# Altium schematic sheet Sheet1.SchDoc
size A4; SheetNumber: 1; SheetTotal: 2; SPICEModelCacheYMMYHAXJ: <root> / <DocumentId>YMMYHAXJ</DocumentId> / <CacheFrame Number="0"> / <Model Name="cap" Kind="MDL"> / <Text>*Default semiconductor capacitor / .MODEL CAP C()</Text> / </Model> / </CacheFrame> / </root>
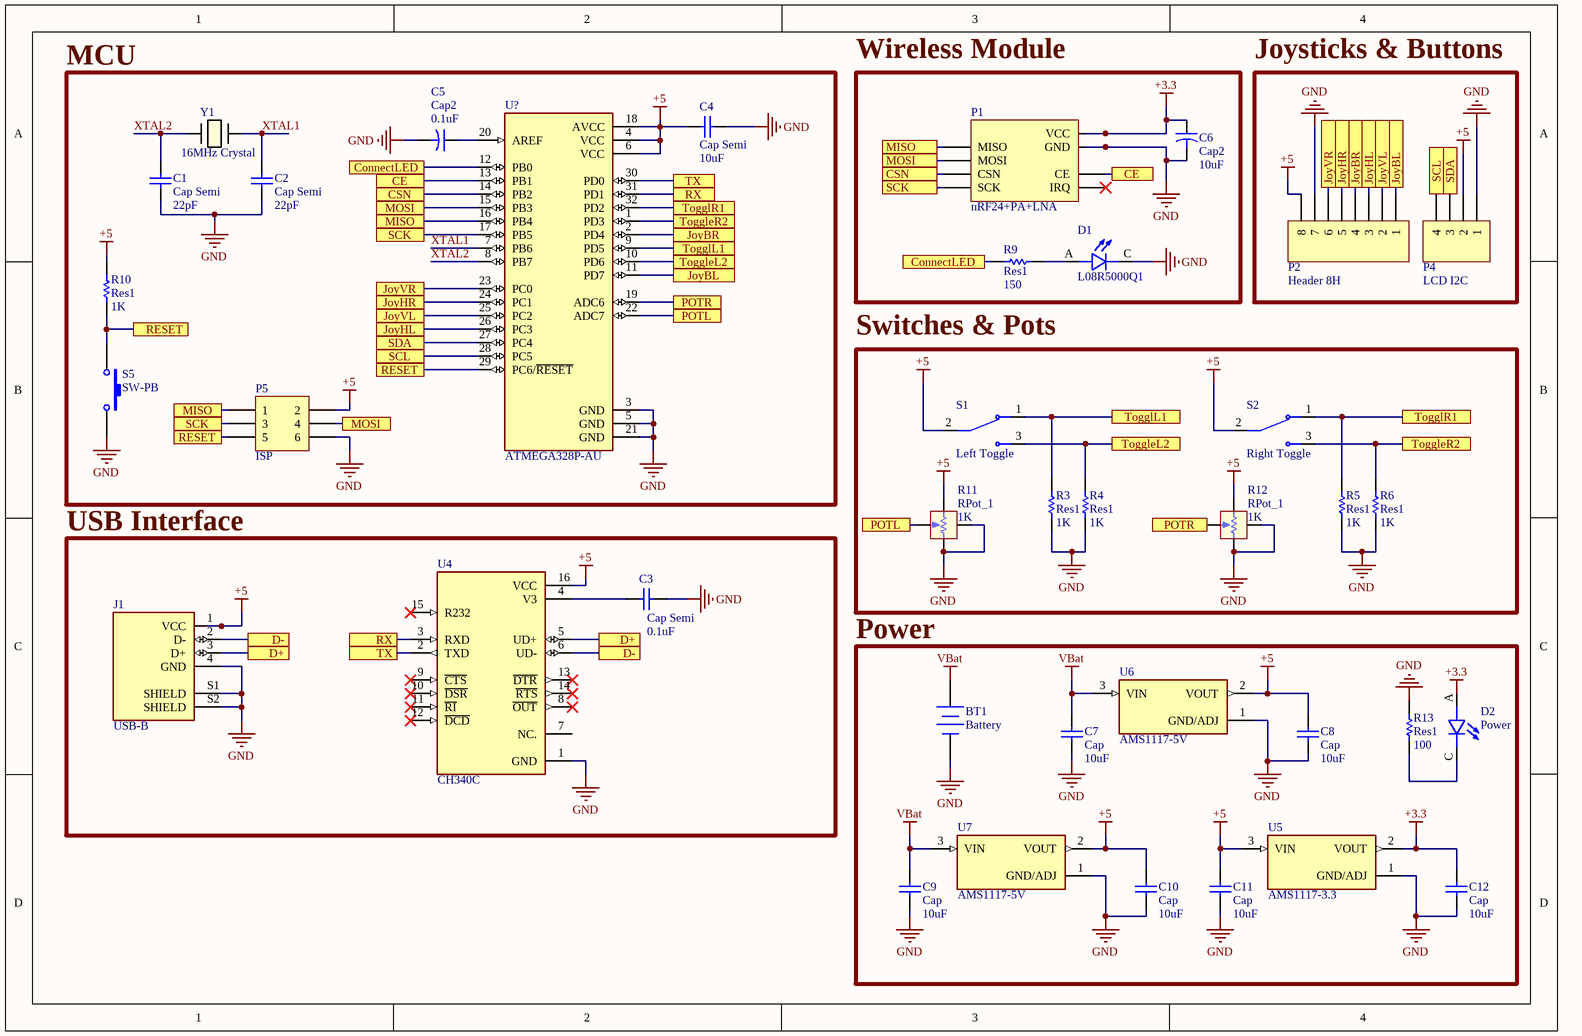
[diagram p0: Sheet1.SchDoc]

## Parts
BT1  Battery  [BAT-2]
C1  Cap Semi  value 22pF  [1608[0603]]
C2  Cap Semi  value 22pF  [1608[0603]]
C3  Cap Semi  value 0.1uF  [C1206]
C4  Cap Semi  value 10uF  [C1210]
C5  Cap2  value 0.1uF  [CAPR5-4X5]
C6  Cap2  value 10uF  [CAPR5-4X5]
C7  Cap  value 10uF  [C1210]
C8  Cap  value 10uF  [C1210]
C9  Cap  value 10uF  [C1210]
C10  Cap  value 10uF  [C1210]
C11  Cap  value 10uF  [C1206]
C12  Cap  value 10uF  [C1206]
D1  L08R5000Q1  [LEDRD254W57D500H1070]
D2  Power  [LEDRD254W57D500H1070]
J1  USB-B  [SAMTEC_USB-B-S-X-X-TH]
P1  nRF24+PA+LNA  [nRF24+PA+LNA]
P2  Header 8H  [HDR1X8H]
P4  LCD I2C  [HDR1X4H]
P5  ISP  [HDR2X3]
R3  Res1  value 1K  [AXIAL-0.3]
R4  Res1  value 1K  [AXIAL-0.3]
R5  Res1  value 1K  [AXIAL-0.3]
R6  Res1  value 1K  [AXIAL-0.3]
R9  Res1  value 150  [AXIAL-0.3]
R10  Res1  value 1K  [AXIAL-0.3]
R11  RPot_1  value 1K  [RV09AF4020KA54]
R12  RPot_1  value 1K  [RV09AF4020KA54]
R13  Res1  value 100  [AXIAL-0.3]
S1  Left Toggle  [SW_100SP1T1B4M2QE]
S2  Right Toggle  [SW_100SP1T1B4M2QE]
S5  SW-PB  [SW_TL3305AF160QG]
U4  CH340C  [SOIC127P600X180-16N]
U5  AMS1117-3.3  [SOT229P700X180-4N]
U6  AMS1117-5V  [SOT229P700X180-4N]
U7  AMS1117-5V  [SOT229P700X180-4N]
U?  ATMEGA328P-AU  [QFP80P900X900X120-32N]
Y1  16MHz Crystal  [H32_RAM]

## Blocks framed on the sheet
MCU: C1 C2 C4 C5 P5 R10 S5 U? Y1
Wireless Module: C6 D1 P1 R9
Joysticks & Buttons: P2 P4
Switches & Pots: R3-R6 R11 R12 S1 S2
USB Interface: C3 J1 U4
Power: BT1 C7-C12 D2 R13 U5-U7

## Ports
CE (see Sheet1[1A]), CE (see Sheet1[3A]), ConnectLED (see Sheet1[1A]), ConnectLED (see Sheet1[3B]), CSN (see Sheet1[1A]), CSN (see Sheet1[3A]), D+ (see Sheet1[1C]), D+ (see Sheet1[2C]), D- (see Sheet1[1C]), D- (see Sheet1[2C]), JoyBL (see Joysticks[3B], Joysticks[4C], Sheet1[2B]), JoyBL (see Joysticks[3B], Joysticks[4C], Sheet1[4A]), JoyBR (see Joysticks[3C], Joysticks[4B], Sheet1[2A]), JoyBR (see Joysticks[3C], Joysticks[4B], Sheet1[4A]), JoyHL (see Joysticks[3A], Joysticks[3C], Sheet1[1B]), JoyHL (see Joysticks[3A], Joysticks[3C], Sheet1[4A]), JoyHR (see Joysticks[3C], Joysticks[4A], Sheet1[1B]), JoyHR (see Joysticks[3C], Joysticks[4A], Sheet1[4A]), JoyVL (see Joysticks[3A], Joysticks[4C], Sheet1[1B]), JoyVL (see Joysticks[3A], Joysticks[4C], Sheet1[4A]), JoyVR (see Joysticks[3C], Joysticks[4A], Sheet1[1B]), JoyVR (see Joysticks[3C], Joysticks[4A], Sheet1[4A]), MISO (see Sheet1[1A], Sheet1[1B]), MISO (see Sheet1[1A], Sheet1[3A]), MISO (see Sheet1[1B], Sheet1[3A]), MOSI (see Sheet1[1A], Sheet1[1B]), MOSI (see Sheet1[1A], Sheet1[3A]), MOSI (see Sheet1[1B], Sheet1[3A]), POTL (see Sheet1[2B]), POTL (see Sheet1[3C]), POTR (see Sheet1[2B]), POTR (see Sheet1[3C]), RESET (see Sheet1[1B]), RX (see Sheet1[1C]), RX (see Sheet1[2A]), SCK (see Sheet1[1A], Sheet1[1B]), SCK (see Sheet1[1A], Sheet1[3A]), SCK (see Sheet1[1B], Sheet1[3A]), SCL (see Sheet1[1B]), SCL (see Sheet1[4A]), SDA (see Sheet1[1B]), SDA (see Sheet1[4A]), ToggleL2 (see Sheet1[2B]), ToggleL2 (see Sheet1[3B]), ToggleR2 (see Sheet1[2A]), ToggleR2 (see Sheet1[4B]), TogglL1 (see Sheet1[2A]), TogglL1 (see Sheet1[3B]), TogglR1 (see Sheet1[2A]), TogglR1 (see Sheet1[4B]), TX (see Sheet1[1C]), TX (see Sheet1[2A])

## Nets
+3.3: C6.1 C12.1 D2.A P1.2(VCC) U5.2(VOUT)
+5: C4.1 C8.1 C10.1 C11.1 J1.1(VCC) P2.8 P4.2 P5.2 R10.2 R11.1(TOP) R12.1(TOP) S1.2 S2.2 U4.16(VCC) U5.3(VIN) U6.2(VOUT) U7.2(VOUT) U?.4(VCC) U?.6(VCC) U?.18(AVCC)
GND: BT1.2(-) C1.2 C2.2 C3.2 C4.2 C5.2 C6.2 C7.2 C8.2 C9.2 C10.2 C11.2 C12.2 D1.C J1.4(GND) J1.S1(SHIELD) J1.S2(SHIELD) P1.1(GND) P2.7 P4.1 P5.6 R3.1 R4.1 R5.1 R6.1 R11.3(BOT) R11.4,5(Chasiss) R12.3(BOT) R12.4,5(Chasiss) R13.2 S5.3,4 U4.1(GND) U5.1(GND/ADJ) U6.1(GND/ADJ) U7.1(GND/ADJ) U?.3(GND) U?.5(GND) U?.21(GND)
VBat: BT1.1(+) C7.1 C9.1 U6.3(VIN) U7.3(VIN)
CE: P1.3(CE) U?.13(PB1) ; port CE
ConnectLED: R9.1 U?.12(PB0) ; port ConnectLED
CSN: P1.4(CSN) U?.14(PB2) ; port CSN
D+: J1.3(D+) U4.5(UD+) ; port D+
D-: J1.2(D-) U4.6(UD-) ; port D-
JoyBL: P2.1 U?.11(PD7) ; port JoyBL
JoyBR: P2.4 U?.2(PD4) ; port JoyBR
JoyHL: P2.3 U?.26(PC3) ; port JoyHL
JoyHR: P2.5 U?.24(PC1) ; port JoyHR
JoyVL: P2.2 U?.25(PC2) ; port JoyVL
JoyVR: P2.6 U?.23(PC0) ; port JoyVR
MISO: P1.7(MISO) P5.1 U?.16(PB4) ; port MISO
MOSI: P1.6(MOSI) P5.4 U?.15(PB3) ; port MOSI
POTL: R11.2(POT) U?.22(ADC7) ; port POTL
POTR: R12.2(POT) U?.19(ADC6) ; port POTR
RESET: P5.5 R10.1 S5.1,2 U?.29(PC6/~{RESET}) ; port RESET
RX: U4.3(RXD) U?.31(PD1) ; port RX
SCK: P1.5(SCK) P5.3 U?.17(PB5) ; port SCK
SCL: P4.4 U?.28(PC5) ; port SCL
SDA: P4.3 U?.27(PC4) ; port SDA
ToggleL2: R4.2 S1.3 U?.10(PD6) ; port ToggleL2
ToggleR2: R6.2 S2.3 U?.1(PD3) ; port ToggleR2
TogglL1: R3.2 S1.1 U?.9(PD5) ; port TogglL1
TogglR1: R5.2 S2.1 U?.32(PD2) ; port TogglR1
TX: U4.2(TXD) U?.30(PD0) ; port TX
XTAL1: C2.1 U?.7(PB6) Y1.2
XTAL2: C1.1 U?.8(PB7) Y1.1
NetC3_1: C3.1 U4.4(V3)
NetC5_1: C5.1 U?.20(AREF)
NetD1_A: D1.A R9.2
NetD2_C: D2.C R13.1

Not connected (* = marked no-connect by the designer): P1 8(IRQ)*; U4 7(NC.) 8(~{OUT})* 9(~{CTS})* 10(~{DSR})* 11(~{RI})* 12(~{DCD})* 13(~{DTR})* 14(~{RTS})* 15(R232)*

## Library data of the parts
BT1 = Battery: Multicell Battery; Published: 24-Mar-1999; LatestRevisionDate: 17-Jul-2002; LatestRevisionNote: Re-released for DXP Platform.; PackageReference: BAT-2; Publisher: Altium Limited; PackageDescription: Battery; 2 Leads
C1-C4 C7-C12 = Cap Semi: Capacitor (Semiconductor SIM Model); Published: 8-Jun-2000; LatestRevisionDate: 29-May-2009; LatestRevisionNote: IPC-7351 Footprint Added.; PackageReference: C1206; Publisher: Altium Limited; PackageDescription: Chip Capacitor
C5 C6 = Cap2: Capacitor; Published: 23-Sep-2002; PackageReference: CAPR5-4X5; Publisher: Altium Limited; PackageDescription: Capacitor; 2 Leads
D1 D2 = L08R5000Q1: LED, 5MM, ORANGE; LED / Lamp Size: 5mm / T-1 3/4; LED Colour: Orange; Typ Luminous Intensity: 4.3mcd; Viewing Angle: ...; MF: LED Technology; Value: *; SnapEDA_Link: https://www.snapeda.com/parts/L08R5000Q1/LED+Technology/view-part/?ref=snap; MP: L08R5000Q1; Check_prices: https://www.snapeda.com/parts/L08R5000Q1/LED+Technology/view-part/?ref=eda; Availability: In Stock; Price: None; Package: None
J1 = USB-B-S-X-X-TH: USB-B (USB TYPE-B) USB 2.0 Receptacle Connector 4 Position Through Hole, Right Angle; MP: USB-B-S-S-B-TH; MF: Samtec; Digi-Key_Part_Number: SAM10869-ND; Check_prices: https://www.snapeda.com/parts/USB-B-S-S-B-TH/Samtec+Inc./view-part/?ref=eda; Package: None; SnapEDA_Link: https://www.snapeda.com/parts/USB-B-S-S-B-TH/Samtec+Inc./view-part/?ref=snap; Value: *; Purchase-URL: https://pricing.snapeda.com/search/part/USB-B-S-S-B-TH/?ref=eda
P1 = nRF24+PA+LNA: Header, 4-Pin, Dual row; LatestRevisionDate: 17-Jul-2002; LatestRevisionNote: Re-released for DXP Platform.; Publisher: Altium Limited
P2 = Header 8H: Header, 8-Pin, Right Angle; LatestRevisionDate: 17-Jul-2002; LatestRevisionNote: Re-released for DXP Platform.; Publisher: Altium Limited
P4 = Header 4H: Header, 4-Pin, Right Angle; LatestRevisionDate: 17-Jul-2002; LatestRevisionNote: Re-released for DXP Platform.; Publisher: Altium Limited
P5 = Header 3X2: Header, 3-Pin, Dual row; LatestRevisionDate: 17-Jul-2002; LatestRevisionNote: Re-released for DXP Platform.; Publisher: Altium Limited
R3-R6 R9 R10 R13 = Res1: Resistor; Published: 8-Jun-2000; LatestRevisionDate: 17-Jul-2002; LatestRevisionNote: Re-released for DXP Platform.; PackageReference: AXIAL-0.3; Publisher: Altium Limited; PackageDescription: Axial Device, Thru-Hole; 2 Leads; 0.3 in Pin Spacing
R11 R12 = RPot_1: Potentiometer; Sim Note: Enter the Resistance value and the set point into parameter fields.; Set Position: 0.5; Published: 8-Jun-2000; LatestRevisionDate: 17-Jul-2002; LatestRevisionNote: Re-released for DXP Platform.; PackageReference: VR5; Publisher: Altium Limited; PackageDescription: Variable Resistor, Thru-Hole; 3 Leads
S1 S2 = 100SP1T1B4M2QE: Toggle Switch SPDT Through Hole; Package: None; Price: None; Value: *; MP: 100SP1T1B4M2QE; Availability: Unavailable
S5 = SW-PB: Switch; Published: 24-Mar-1999; LatestRevisionDate: 17-Jul-2002; LatestRevisionNote: Re-released for DXP Platform.; PackageReference: SPST-2; Publisher: Altium Limited; PackageDescription: Switch; 2 Leads
U4 = CH340C: USB to serial chip CH340; MF: WCH; Price: None; Availability: Not in stock; MP: CH340C; Package: None; SnapEDA_Link: https://www.snapeda.com/parts/CH340C/WCH/view-part/?ref=snap; Check_prices: https://www.snapeda.com/parts/CH340C/WCH/view-part/?ref=eda; Value: *
U5-U7 = AMS1117-3.3: Sot223/Pkg 1-Amp 3.3-Volt Low Drop Out Voltage Regulatator; MF: Advanced Monolithic Systems; Value: *; SnapEDA_Link: https://www.snapeda.com/parts/AMS1117-3.3/Advanced+Monolithic+Systems/view-part/?ref=snap; Availability: Not in stock; Price: None; Package: SOT-223 Seeed Technology; Check_prices: https://www.snapeda.com/parts/AMS1117-3.3/Advanced+Monolithic+Systems/view-part/?ref=eda; MP: AMS1117-3.3
U? = ATMEGA328P-AU: AVR AVRÂ® ATmega Microcontroller IC 8-Bit 20MHz 32KB (16K x 16) FLASH 32-TQFP (7x7); MF: Microchip Technology; Value: *; SnapEDA_Link: https://www.snapeda.com/parts/ATMEGA328P-AU/Microchip/view-part/?ref=snap; MP: ATMEGA328P-AU; Purchase-URL: https://pricing.snapeda.com/search/part/ATMEGA328P-AU/?ref=eda; Check_prices: https://www.snapeda.com/parts/ATMEGA328P-AU/Microchip/view-part/?ref=eda; Availability: In Stock; Price: None; Package: TQFP-32 Microchip
Y1 = HC49/US-10.244MHZ-16PF-30-EXT-SMD-H32-TR: No Description Available; Mfr_Name: Rami Technology; Copyright: Copyright (C) 2023 Ultra Librarian. All rights reserved.; Manufacturer_Part_Number: HC49/US-10.244MHZ-16PF-30-EXT-SMD-H32-TR; RefDes: RefDes; Type: DEV